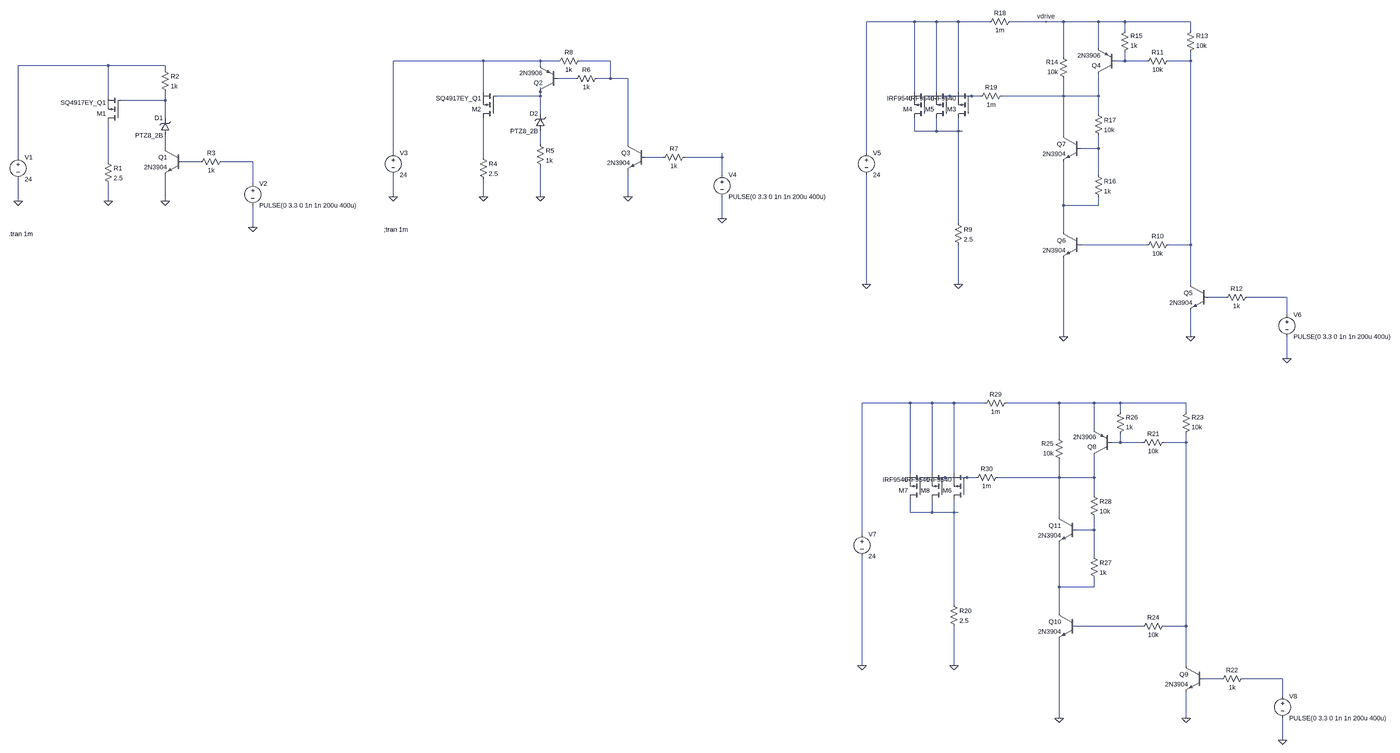
[diagram p0: schematic gate_drivers.asc, whole sheet]
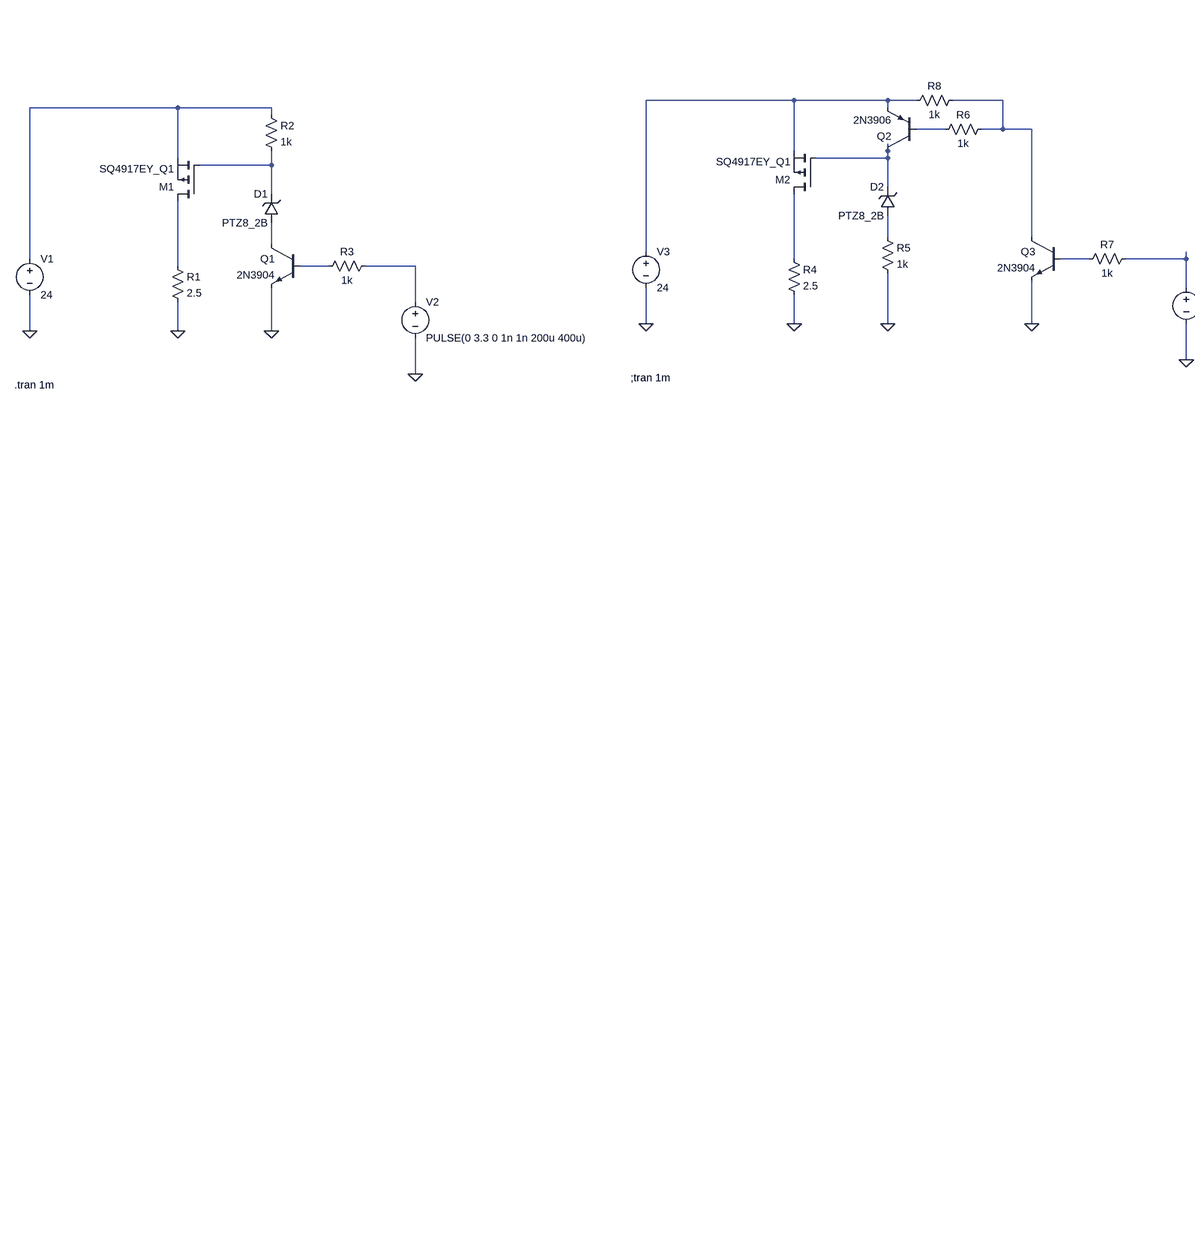
[diagram p1: schematic gate_drivers.asc, part, row 1 of 1, column 1 of 2]
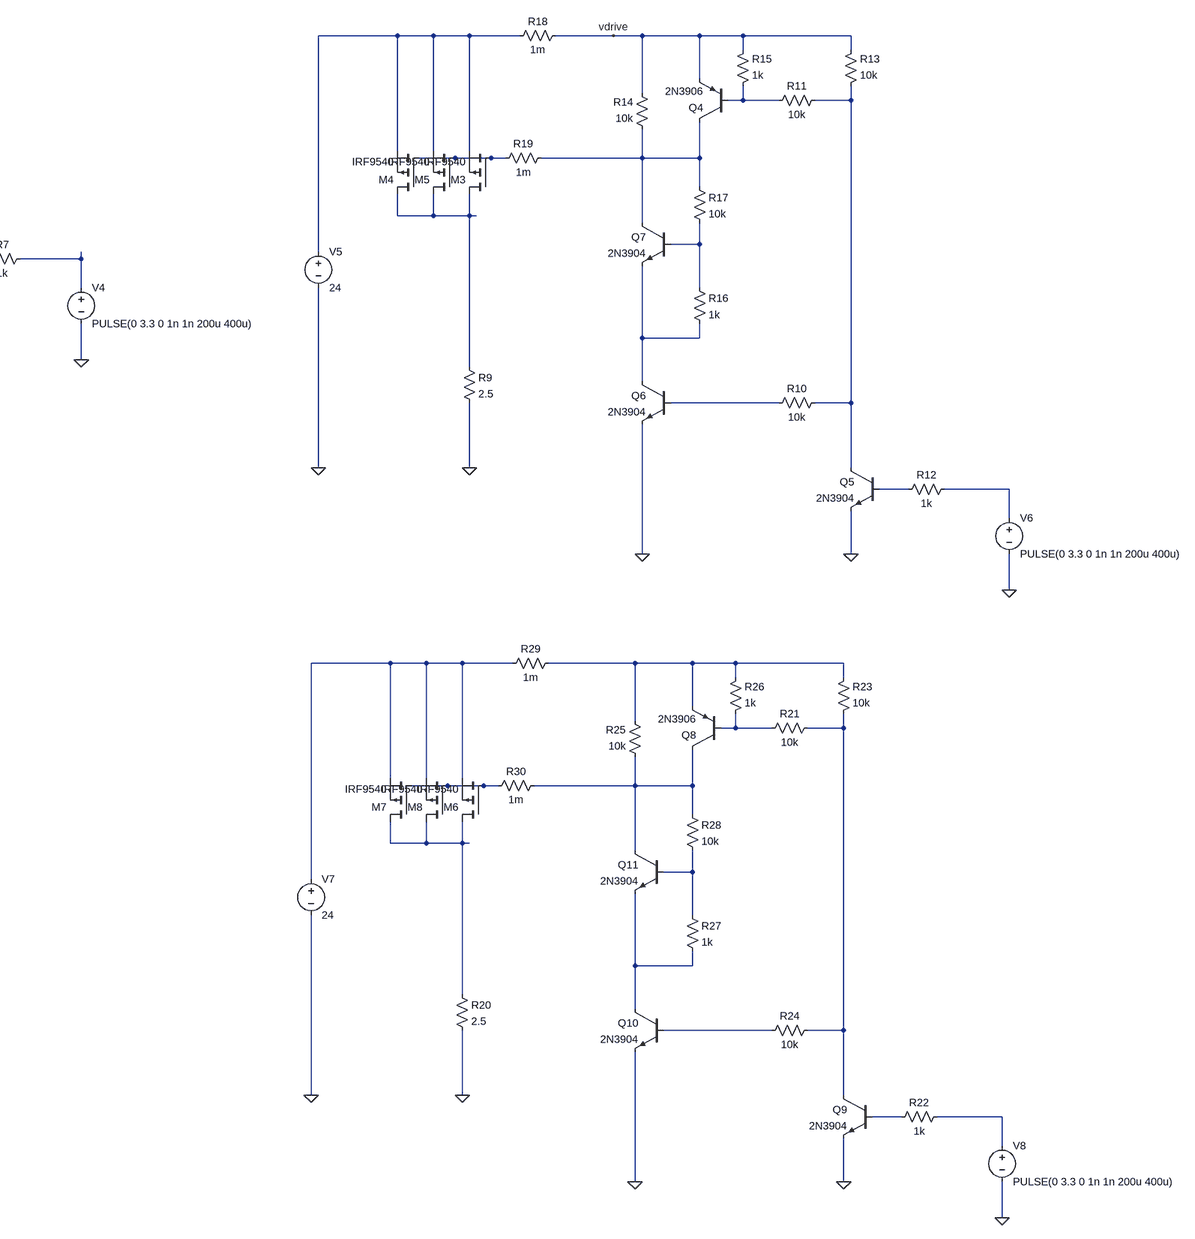
[diagram p2: schematic gate_drivers.asc, part, row 1 of 1, column 2 of 2]
gate_drivers.asc, the LTspice schematic file:
Version 4
SHEET 1 5012 2260
WIRE 3248 -400 3072 -400
WIRE 3328 -400 3248 -400
WIRE 3408 -400 3328 -400
WIRE 3520 -400 3408 -400
WIRE 3728 -400 3600 -400
WIRE 3792 -400 3728 -400
WIRE 3920 -400 3792 -400
WIRE 4016 -400 3920 -400
WIRE 4256 -400 4016 -400
WIRE 4016 -368 4016 -400
WIRE 4256 -368 4256 -400
WIRE 3920 -304 3920 -400
WIRE 3792 -272 3792 -400
WIRE 1600 -256 1264 -256
WIRE 1808 -256 1600 -256
WIRE 1872 -256 1808 -256
WIRE 2064 -256 1952 -256
WIRE 4016 -256 4016 -288
WIRE 4016 -256 3984 -256
WIRE 4096 -256 4016 -256
WIRE 4256 -256 4256 -288
WIRE 4256 -256 4176 -256
WIRE 128 -240 -208 -240
WIRE 336 -240 128 -240
WIRE 1808 -240 1808 -256
WIRE 336 -224 336 -240
WIRE 1936 -192 1872 -192
WIRE 2064 -192 2064 -256
WIRE 2064 -192 2016 -192
WIRE 2128 -192 2064 -192
WIRE 1600 -144 1600 -256
WIRE 1808 -144 1808 -160
WIRE 3248 -144 3248 -400
WIRE 3328 -144 3328 -400
WIRE 3408 -144 3408 -400
WIRE 128 -128 128 -240
WIRE 1808 -128 1808 -144
WIRE 1808 -128 1648 -128
WIRE 3376 -128 3296 -128
WIRE 3456 -128 3376 -128
WIRE 3488 -128 3456 -128
WIRE 3792 -128 3792 -192
WIRE 3792 -128 3568 -128
WIRE 3920 -128 3920 -208
WIRE 3920 -128 3792 -128
WIRE 336 -112 336 -144
WIRE 336 -112 176 -112
WIRE 1808 -64 1808 -128
WIRE 3920 -64 3920 -128
WIRE 336 -48 336 -112
WIRE 3248 0 3248 -48
WIRE 3328 0 3328 -48
WIRE 3328 0 3248 0
WIRE 3408 0 3408 -48
WIRE 3408 0 3328 0
WIRE 3424 0 3408 0
WIRE 3792 16 3792 -128
WIRE 1808 48 1808 0
WIRE 2128 48 2128 -192
WIRE 336 64 336 16
WIRE 3920 64 3920 16
WIRE 3920 64 3856 64
WIRE 1264 80 1264 -256
WIRE 3072 80 3072 -400
WIRE -208 96 -208 -240
WIRE 1600 96 1600 -48
WIRE 2256 96 2192 96
WIRE 2480 96 2480 80
WIRE 2480 96 2336 96
WIRE 128 112 128 -32
WIRE 464 112 400 112
WIRE 656 112 544 112
WIRE 2480 160 2480 96
WIRE 3920 160 3920 64
WIRE 656 192 656 112
WIRE 1264 240 1264 160
WIRE 1600 240 1600 176
WIRE 1808 240 1808 128
WIRE 2128 240 2128 144
WIRE -208 256 -208 176
WIRE 128 256 128 192
WIRE 336 256 336 160
WIRE 3792 272 3792 112
WIRE 3920 272 3920 240
WIRE 3920 272 3792 272
WIRE 2480 320 2480 240
WIRE 3408 336 3408 0
WIRE 656 352 656 272
WIRE 3792 368 3792 272
WIRE 4096 416 3856 416
WIRE 4256 416 4256 -256
WIRE 4256 416 4176 416
WIRE 3072 560 3072 160
WIRE 3408 560 3408 416
WIRE 4256 560 4256 416
WIRE 4384 608 4320 608
WIRE 4608 608 4464 608
WIRE 4608 672 4608 608
WIRE 3792 752 3792 464
WIRE 4256 752 4256 656
WIRE 4608 832 4608 752
WIRE 3232 1008 3056 1008
WIRE 3312 1008 3232 1008
WIRE 3392 1008 3312 1008
WIRE 3504 1008 3392 1008
WIRE 3776 1008 3584 1008
WIRE 3904 1008 3776 1008
WIRE 4000 1008 3904 1008
WIRE 4240 1008 4000 1008
WIRE 4000 1040 4000 1008
WIRE 4240 1040 4240 1008
WIRE 3904 1104 3904 1008
WIRE 3776 1136 3776 1008
WIRE 4000 1152 4000 1120
WIRE 4000 1152 3968 1152
WIRE 4080 1152 4000 1152
WIRE 4240 1152 4240 1120
WIRE 4240 1152 4160 1152
WIRE 3232 1264 3232 1008
WIRE 3312 1264 3312 1008
WIRE 3392 1264 3392 1008
WIRE 3360 1280 3280 1280
WIRE 3440 1280 3360 1280
WIRE 3472 1280 3440 1280
WIRE 3776 1280 3776 1216
WIRE 3776 1280 3552 1280
WIRE 3904 1280 3904 1200
WIRE 3904 1280 3776 1280
WIRE 3904 1344 3904 1280
WIRE 3232 1408 3232 1360
WIRE 3312 1408 3312 1360
WIRE 3312 1408 3232 1408
WIRE 3392 1408 3392 1360
WIRE 3392 1408 3312 1408
WIRE 3408 1408 3392 1408
WIRE 3776 1424 3776 1280
WIRE 3904 1472 3904 1424
WIRE 3904 1472 3840 1472
WIRE 3056 1488 3056 1008
WIRE 3904 1568 3904 1472
WIRE 3776 1680 3776 1520
WIRE 3904 1680 3904 1648
WIRE 3904 1680 3776 1680
WIRE 3392 1744 3392 1408
WIRE 3776 1776 3776 1680
WIRE 4080 1824 3840 1824
WIRE 4240 1824 4240 1152
WIRE 4240 1824 4160 1824
WIRE 3056 1968 3056 1568
WIRE 3392 1968 3392 1824
WIRE 4240 1968 4240 1824
WIRE 4368 2016 4304 2016
WIRE 4592 2016 4448 2016
WIRE 4592 2080 4592 2016
WIRE 3776 2160 3776 1872
WIRE 4240 2160 4240 2064
WIRE 4592 2240 4592 2160
FLAG 128 256 0
FLAG -208 256 0
FLAG 336 256 0
FLAG 656 352 0
FLAG 1600 240 0
FLAG 1264 240 0
FLAG 1808 240 0
FLAG 2480 320 0
FLAG 2128 240 0
FLAG 3408 560 0
FLAG 3072 560 0
FLAG 3792 752 0
FLAG 4608 832 0
FLAG 4256 752 0
FLAG 3728 -400 vdrive
FLAG 3392 1968 0
FLAG 3056 1968 0
FLAG 3776 2160 0
FLAG 4592 2240 0
FLAG 4240 2160 0
SYMBOL res 112 96 R0
SYMATTR InstName R1
SYMATTR Value 2.5
SYMBOL pmos 176 -32 R180
SYMATTR InstName M1
SYMATTR Value SQ4917EY_Q1
SYMBOL voltage -208 80 R0
WINDOW 123 0 0 Left 0
WINDOW 39 0 0 Left 0
SYMATTR InstName V1
SYMATTR Value 24
SYMBOL res 320 -240 R0
SYMATTR InstName R2
SYMATTR Value 1k
SYMBOL npn 400 64 M0
SYMATTR InstName Q1
SYMATTR Value 2N3904
SYMBOL res 560 96 R90
WINDOW 0 0 56 VBottom 2
WINDOW 3 32 56 VTop 2
SYMATTR InstName R3
SYMATTR Value 1k
SYMBOL voltage 656 176 R0
WINDOW 123 0 0 Left 0
WINDOW 39 0 0 Left 0
SYMATTR InstName V2
SYMATTR Value PULSE(0 3.3 0 1n 1n 200u 400u)
SYMBOL zener 352 16 R180
WINDOW 0 24 64 Left 2
WINDOW 3 24 0 Left 2
SYMATTR InstName D1
SYMATTR Value PTZ8_2B
SYMBOL res 1584 80 R0
SYMATTR InstName R4
SYMATTR Value 2.5
SYMBOL pmos 1648 -48 R180
SYMATTR InstName M2
SYMATTR Value SQ4917EY_Q1
SYMBOL voltage 1264 64 R0
WINDOW 123 0 0 Left 0
WINDOW 39 0 0 Left 0
SYMATTR InstName V3
SYMATTR Value 24
SYMBOL res 1792 32 R0
SYMATTR InstName R5
SYMATTR Value 1k
SYMBOL res 2032 -208 R90
WINDOW 0 0 56 VBottom 2
WINDOW 3 32 56 VTop 2
SYMATTR InstName R6
SYMATTR Value 1k
SYMBOL voltage 2480 144 R0
WINDOW 123 0 0 Left 0
WINDOW 39 0 0 Left 0
SYMATTR InstName V4
SYMATTR Value PULSE(0 3.3 0 1n 1n 200u 400u)
SYMBOL zener 1824 0 R180
WINDOW 0 24 64 Left 2
WINDOW 3 24 0 Left 2
SYMATTR InstName D2
SYMATTR Value PTZ8_2B
SYMBOL pnp 1872 -144 R180
SYMATTR InstName Q2
SYMATTR Value 2N3906
SYMBOL npn 2192 48 M0
SYMATTR InstName Q3
SYMATTR Value 2N3904
SYMBOL res 2352 80 R90
WINDOW 0 0 56 VBottom 2
WINDOW 3 32 56 VTop 2
SYMATTR InstName R7
SYMATTR Value 1k
SYMBOL res 1968 -272 R90
WINDOW 0 0 56 VBottom 2
WINDOW 3 32 56 VTop 2
SYMATTR InstName R8
SYMATTR Value 1k
SYMBOL res 3392 320 R0
SYMATTR InstName R9
SYMATTR Value 2.5
SYMBOL pmos 3456 -48 R180
SYMATTR InstName M3
SYMATTR Value IRF9540
SYMBOL voltage 3072 64 R0
WINDOW 123 0 0 Left 0
WINDOW 39 0 0 Left 0
SYMATTR InstName V5
SYMATTR Value 24
SYMBOL res 4192 -272 R90
WINDOW 0 0 56 VBottom 2
WINDOW 3 32 56 VTop 2
SYMATTR InstName R11
SYMATTR Value 10k
SYMBOL voltage 4608 656 R0
WINDOW 123 0 0 Left 0
WINDOW 39 0 0 Left 0
SYMATTR InstName V6
SYMATTR Value PULSE(0 3.3 0 1n 1n 200u 400u)
SYMBOL pnp 3984 -208 R180
SYMATTR InstName Q4
SYMATTR Value 2N3906
SYMBOL npn 4320 560 M0
SYMATTR InstName Q5
SYMATTR Value 2N3904
SYMBOL res 4480 592 R90
WINDOW 0 0 56 VBottom 2
WINDOW 3 32 56 VTop 2
SYMATTR InstName R12
SYMATTR Value 1k
SYMBOL res 4240 -272 M180
WINDOW 0 36 76 Left 2
WINDOW 3 36 40 Left 2
SYMATTR InstName R13
SYMATTR Value 10k
SYMBOL npn 3856 368 M0
SYMATTR InstName Q6
SYMATTR Value 2N3904
SYMBOL res 4192 400 R90
WINDOW 0 0 56 VBottom 2
WINDOW 3 32 56 VTop 2
SYMATTR InstName R10
SYMATTR Value 10k
SYMBOL res 3808 -176 R180
WINDOW 0 36 76 Left 2
WINDOW 3 36 40 Left 2
SYMATTR InstName R14
SYMATTR Value 10k
SYMBOL res 4000 -272 M180
WINDOW 0 36 76 Left 2
WINDOW 3 36 40 Left 2
SYMATTR InstName R15
SYMATTR Value 1k
SYMBOL pmos 3296 -48 R180
SYMATTR InstName M4
SYMATTR Value IRF9540
SYMBOL pmos 3376 -48 R180
SYMATTR InstName M5
SYMATTR Value IRF9540
SYMBOL npn 3856 16 M0
SYMATTR InstName Q7
SYMATTR Value 2N3904
SYMBOL res 3904 144 R0
SYMATTR InstName R16
SYMATTR Value 1k
SYMBOL res 3904 -80 R0
SYMATTR InstName R17
SYMATTR Value 10k
SYMBOL res 3504 -384 R270
WINDOW 0 32 56 VTop 2
WINDOW 3 0 56 VBottom 2
SYMATTR InstName R18
SYMATTR Value 1m
SYMBOL res 3584 -144 R90
WINDOW 0 0 56 VBottom 2
WINDOW 3 32 56 VTop 2
SYMATTR InstName R19
SYMATTR Value 1m
SYMBOL res 3376 1728 R0
SYMATTR InstName R20
SYMATTR Value 2.5
SYMBOL pmos 3440 1360 R180
SYMATTR InstName M6
SYMATTR Value IRF9540
SYMBOL voltage 3056 1472 R0
WINDOW 123 0 0 Left 0
WINDOW 39 0 0 Left 0
SYMATTR InstName V7
SYMATTR Value 24
SYMBOL res 4176 1136 R90
WINDOW 0 0 56 VBottom 2
WINDOW 3 32 56 VTop 2
SYMATTR InstName R21
SYMATTR Value 10k
SYMBOL voltage 4592 2064 R0
WINDOW 123 0 0 Left 0
WINDOW 39 0 0 Left 0
SYMATTR InstName V8
SYMATTR Value PULSE(0 3.3 0 1n 1n 200u 400u)
SYMBOL pnp 3968 1200 R180
SYMATTR InstName Q8
SYMATTR Value 2N3906
SYMBOL npn 4304 1968 M0
SYMATTR InstName Q9
SYMATTR Value 2N3904
SYMBOL res 4464 2000 R90
WINDOW 0 0 56 VBottom 2
WINDOW 3 32 56 VTop 2
SYMATTR InstName R22
SYMATTR Value 1k
SYMBOL res 4224 1136 M180
WINDOW 0 36 76 Left 2
WINDOW 3 36 40 Left 2
SYMATTR InstName R23
SYMATTR Value 10k
SYMBOL npn 3840 1776 M0
SYMATTR InstName Q10
SYMATTR Value 2N3904
SYMBOL res 4176 1808 R90
WINDOW 0 0 56 VBottom 2
WINDOW 3 32 56 VTop 2
SYMATTR InstName R24
SYMATTR Value 10k
SYMBOL res 3792 1232 R180
WINDOW 0 36 76 Left 2
WINDOW 3 36 40 Left 2
SYMATTR InstName R25
SYMATTR Value 10k
SYMBOL res 3984 1136 M180
WINDOW 0 36 76 Left 2
WINDOW 3 36 40 Left 2
SYMATTR InstName R26
SYMATTR Value 1k
SYMBOL pmos 3280 1360 R180
SYMATTR InstName M7
SYMATTR Value IRF9540
SYMBOL pmos 3360 1360 R180
SYMATTR InstName M8
SYMATTR Value IRF9540
SYMBOL npn 3840 1424 M0
SYMATTR InstName Q11
SYMATTR Value 2N3904
SYMBOL res 3888 1552 R0
SYMATTR InstName R27
SYMATTR Value 1k
SYMBOL res 3888 1328 R0
SYMATTR InstName R28
SYMATTR Value 10k
SYMBOL res 3488 1024 R270
WINDOW 0 32 56 VTop 2
WINDOW 3 0 56 VBottom 2
SYMATTR InstName R29
SYMATTR Value 1m
SYMBOL res 3568 1264 R90
WINDOW 0 0 56 VBottom 2
WINDOW 3 32 56 VTop 2
SYMATTR InstName R30
SYMATTR Value 1m
TEXT -242 376 Left 2 !.tran 1m
TEXT 1230 360 Left 2 !;tran 1m

The netlist it stands for:
* gate_drivers.asc
R1 N019 0 2.5
M1 N019 N011 N006 N006 SQ4917EY_Q1
V1 N006 0 24
R2 N006 N011 1k
Q1 N014 N020 0 0 2N3904
R3 N021 N020 1k
V2 N021 0 PULSE(0 3.3 0 1n 1n 200u 400u)
D1 N014 N011 PTZ8_2B
R4 N016 0 2.5
M2 N016 N008 N002 N002 SQ4917EY_Q1
V3 N002 0 24
R5 N013 0 1k
R6 N003 N007 1k
V4 N018 0 PULSE(0 3.3 0 1n 1n 200u 400u)
D2 N013 N008 PTZ8_2B
Q2 N008 N007 N002 0 2N3906
Q3 N003 N017 0 0 2N3904
R7 N018 N017 1k
R8 N003 N002 1k
R9 N012 0 2.5
M3 N012 N009 N001 N001 IRF9540
V5 N001 0 24
R11 N005 N004 10k
V6 N025 0 PULSE(0 3.3 0 1n 1n 200u 400u)
Q4 N010 N004 vdrive 0 2N3906
Q5 N005 N024 0 0 2N3904
R12 N025 N024 1k
R13 N005 vdrive 10k
Q6 N022 N023 0 0 2N3904
R10 N005 N023 10k
R14 N010 vdrive 10k
R15 N004 vdrive 1k
M4 N012 N009 N001 N001 IRF9540
M5 N012 N009 N001 N001 IRF9540
Q7 N010 N015 N022 0 2N3904
R16 N015 N022 1k
R17 N010 N015 10k
R18 N001 vdrive 1m
R19 N010 N009 1m
R20 N032 0 2.5
M6 N032 N030 N026 N026 IRF9540
V7 N026 0 24
R21 N029 N028 10k
V8 N037 0 PULSE(0 3.3 0 1n 1n 200u 400u)
Q8 N031 N028 N027 0 2N3906
Q9 N029 N036 0 0 2N3904
R22 N037 N036 1k
R23 N029 N027 10k
Q10 N034 N035 0 0 2N3904
R24 N029 N035 10k
R25 N031 N027 10k
R26 N028 N027 1k
M7 N032 N030 N026 N026 IRF9540
M8 N032 N030 N026 N026 IRF9540
Q11 N031 N033 N034 0 2N3904
R27 N033 N034 1k
R28 N031 N033 10k
R29 N026 N027 1m
R30 N031 N030 1m
.model D D
.lib standard.dio
.model NPN NPN
.model PNP PNP
.lib standard.bjt
.model NMOS NMOS
.model PMOS PMOS
.lib standard.mos
.tran 1m
;tran 1m
.backanno
.end